# Altium schematic sheet Top.SchDoc
size A4; SheetNumber: 1; SheetTotal: 4
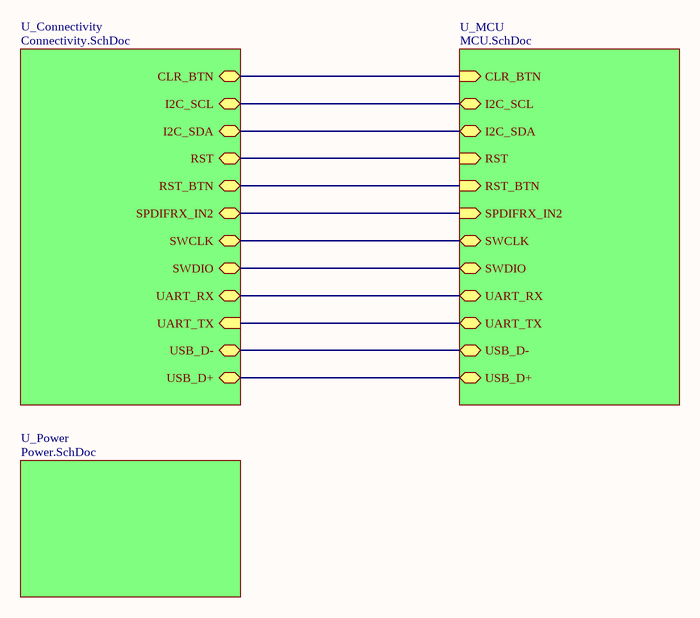
[diagram p0: Top.SchDoc]

## Sub-sheets
U_Connectivity = Connectivity.SchDoc: SPDIFRX_IN2 (bidir), RST_BTN (bidir), CLR_BTN (bidir), I2C_SDA (bidir), I2C_SCL (bidir), UART_RX (bidir), UART_TX (in), RST (bidir), SWCLK (bidir), SWDIO (bidir), USB_D- (bidir), USB_D+ (bidir)
U_MCU = MCU.SchDoc: RST_BTN (in), SPDIFRX_IN2 (in), CLR_BTN (in), SWCLK (bidir), SWDIO (bidir), I2C_SCL (bidir), I2C_SDA (bidir), UART_TX (bidir), UART_RX (bidir), USB_D- (bidir), USB_D+ (bidir), RST (in)
U_Power = Power.SchDoc: no entries

## Nets
(unnamed): sheet U_MCU/RST_BTN, sheet U_Connectivity/RST_BTN
(unnamed): sheet U_MCU/SPDIFRX_IN2, sheet U_Connectivity/SPDIFRX_IN2
(unnamed): sheet U_MCU/CLR_BTN, sheet U_Connectivity/CLR_BTN
(unnamed): sheet U_MCU/SWCLK, sheet U_Connectivity/SWCLK
(unnamed): sheet U_MCU/SWDIO, sheet U_Connectivity/SWDIO
(unnamed): sheet U_MCU/I2C_SCL, sheet U_Connectivity/I2C_SCL
(unnamed): sheet U_MCU/I2C_SDA, sheet U_Connectivity/I2C_SDA
(unnamed): sheet U_MCU/UART_TX, sheet U_Connectivity/UART_TX
(unnamed): sheet U_MCU/UART_RX, sheet U_Connectivity/UART_RX
(unnamed): sheet U_MCU/USB_D-, sheet U_Connectivity/USB_D-
(unnamed): sheet U_MCU/USB_D+, sheet U_Connectivity/USB_D+
(unnamed): sheet U_MCU/RST, sheet U_Connectivity/RST